# Altium schematic sheet US_BB_SH.SchDoc
size A4
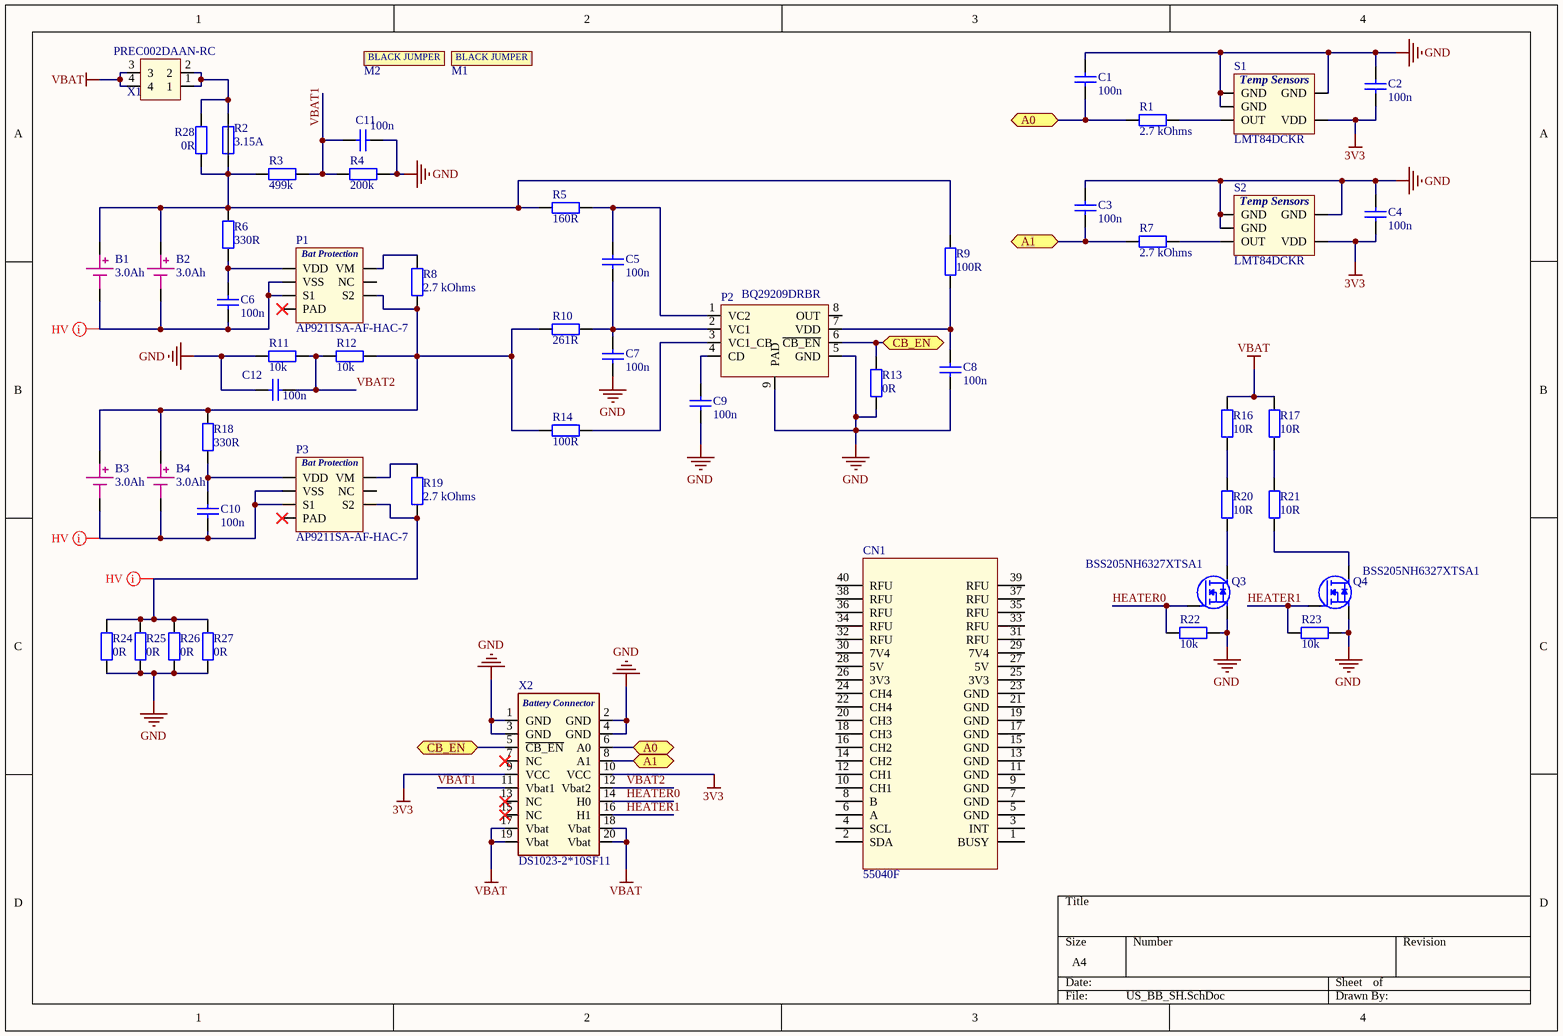
[diagram p0: US_BB_SH.SchDoc]

## Parts
B1  3.0Ah  [BAT18650 1S-MSL]
B2  3.0Ah  [BAT18650 1S-MSL]
B3  3.0Ah  [BAT18650 1S-MSL]
B4  3.0Ah  [BAT18650 1S-MSL]
C1  100n  [C0603_IPC_HD]
C2  100n  [C0603_IPC_HD]
C3  100n  [C0603_IPC_HD]
C4  100n  [C0603_IPC_HD]
C5  100n  [C0603_IPC_HD]
C6  100n  [C0603_IPC_HD]
C7  100n  [C0603_IPC_HD]
C8  100n  [C0603_IPC_HD]
C9  100n  [C0603_IPC_HD]
C10  100n  [C0603_IPC_HD]
C11  100n  [C0603_IPC_HD]
C12  100n  [C0603_IPC_HD]
CN1  55040F  [HEADER_40PIN_12MM2]
M1  STC02SYAN  (value not drawn)  (mechanical)
M2  STC02SYAN  (value not drawn)  (mechanical)
P1  AP9211SA-AF-HAC-7  [U-DFN2030-6 (Type C)]
P2  BQ29209DRBR  [bq29209_SON65P300X100_HS-9N]
P3  AP9211SA-AF-HAC-7  [U-DFN2030-6 (Type C)]
Q3  BSS205NH6327XTSA1  [SOT23]
Q4  BSS205NH6327XTSA1  [SOT23]
R1  2.7 kOhms  [C0805_IPC_HD]
R2  3.15A  [C0603_IPC_MD]
R3  499k  [C0603_IPC_HD]
R4  200k  [C0603_IPC_HD]
R5  160R  [C0805_IPC_HD]
R6  330R  [C0805_IPC_HD]
R7  2.7 kOhms  [C0805_IPC_HD]
R8  2.7 kOhms  [C0805_IPC_HD]
R9  100R  [R0805_IPC_MD]
R10  261R  [C0805_IPC_HD]
R11  10k  [C0603_IPC_HD]
R12  10k  [C0603_IPC_HD]
R13  0R  [R0603_IPC_MD]
R14  100R  [R0805_IPC_MD]
R16  10R  [FMP300JT-73-10R]
R17  10R  [FMP300JT-73-10R]
R18  330R  [C0805_IPC_HD]
R19  2.7 kOhms  [C0805_IPC_HD]
R20  10R  [FMP300JT-73-10R]
R21  10R  [FMP300JT-73-10R]
R22  10k  [C0603_IPC_HD]
R23  10k  [C0603_IPC_HD]
R24  0R  [R0603_IPC_MD]
R25  0R  [R0603_IPC_MD]
R26  0R  [R0603_IPC_MD]
R27  0R  [R0603_IPC_MD]
R28  0R  [R0603_IPC_MD]  (no BOM)
S1  LMT84DCKR  [LMT84DCKR_SOT65P210X110-5N]
S2  LMT84DCKR  [LMT84DCKR_SOT65P210X110-5N]
X1  PREC002DAAN-RC  [GPLD_2X2]
X2  DS1023-2*10SF11  [ESQ-110-33-T-D]

## Ports
A0, A1, CB_EN

## Nets
3V3: C2.1 C4.1 S1.4(VDD) S2.4(VDD) X2.9(VCC) X2.10(VCC)
GND: C1.2 C2.2 C3.2 C4.2 C7.1 C8.1 C9.1 C11.2 C12.1 P2.5(GND) P2.9(PAD) Q3.2(S) Q4.2(S) R4.2 R11.1 R13.1 R22.1 R23.2 R24.1 R25.1 R26.1 R27.1 S1.1(GND) S1.2(GND) S1.5(GND) S2.1(GND) S2.2(GND) S2.5(GND) X2.1(GND) X2.2(GND) X2.3(GND) X2.4(GND)
VBAT: R16.2 R17.2 X1.3 X1.4 X2.17(Vbat) X2.18(Vbat) X2.19(Vbat) X2.20(Vbat)
A0: C1.1 R1.1 X2.6(A0) ; port A0
A1: C3.1 R7.1 X2.8(A1) ; port A1
CB_EN: P2.6(~{CB_EN}) R13.2 X2.5(~{CB_EN}) ; port CB_EN
HEATER0: Q3.1(G) R22.2 X2.14(H0)
HEATER1: Q4.1(G) R23.1 X2.16(H1)
VBAT1: C11.1 R3.2 R4.1 X2.11(Vbat1)
VBAT2: C12.2 R11.2 R12.1 X2.12(Vbat2)
NetB1_1: B1.1 B2.1 R2.1 R3.1 R5.1 R6.2 R9.2 R28.1
NetB1_2: B1.2 B2.2 C6.1 P1.1(S1) P1.2(VSS)
NetB3_1: B3.1 B4.1 P1.6(S2) R8.1 R10.1 R12.2 R14.2 R18.2
NetB3_2: B3.2 B4.2 C10.1 P3.1(S1) P3.2(VSS)
NetC5_1: C5.1 C7.2 P2.2(VC1) R10.2
NetC5_2: C5.2 P2.1(VC2) R5.2
NetC6_2: C6.2 P1.3(VDD) R6.1
NetC8_2: C8.2 P2.7(VDD) R9.1
NetC9_2: C9.2 P2.4(CD)
NetC10_2: C10.2 P3.3(VDD) R18.1
NetP1_5: P1.5(VM) R8.2
NetP2_3: P2.3(VC1_CB) R14.1
NetP3_5: P3.5(VM) R19.2
NetP3_6: P3.6(S2) R19.1 R24.2 R25.2 R26.2 R27.2
NetQ3_3: Q3.3(D) R20.1
NetQ4_3: Q4.3(D) R21.1
NetR1_2: R1.2 S1.3(OUT)
NetR2_2: R2.2 R28.2 X1.1 X1.2
NetR7_2: R7.2 S2.3(OUT)
NetR16_1: R16.1 R20.2
NetR17_1: R17.1 R21.2

Not connected (* = marked no-connect by the designer): CN1 1(BUSY) 2(SDA) 3(INT) 4(SCL) 5(GND) 6(A) 7(GND) 8(B) 9(GND) 10(CH1) 11(GND) 12(CH1) 13(GND) 14(CH2) 15(GND) 16(CH2) 17(GND) 18(CH3) 19(GND) 20(CH3) 21(GND) 22(CH4) 23(GND) 24(CH4) 25(3V3) 26(3V3) 27(5V) 28(5V) 29(7V4) 30(7V4) 31(RFU) 32(RFU) 33(RFU) 34(RFU) 35(RFU) 36(RFU) 37(RFU) 38(RFU) 39(RFU) 40(RFU); P1 4(NC) 7(PAD)*; P2 8(OUT); P3 4(NC) 7(PAD)*; X2 7(NC)* 13(NC)* 15(NC)*

## Layout directives
net class HV: NetB1_2, NetB3_2, NetP3_6

## Notes on the sheet
- (in symbol AP9211SA-AF) Bat Protection
- (in symbol DS1023-2*10SF11) Battery Connector
- (in symbol LMT84DCKR) Temp Sensors
- (in symbol STC02SYAN) BLACK JUMPER

## Library data of the parts
B1-B4 = 18650 3.7V Li-ion: 18650 3.7V Lithium-Ion Battery Rechargeable (Secondary) 2.6Ah; Manufacturer: Litokala; Manufacturer Part Number: Litokala_HG2; Voltage: 3.7V; Capacity: 3.0Ah; Battery Chemistry: Lithium-Ion; Supplier 1: Aliexpress; Supplier Part Number 1: 490-10517-2-ND
C1-C12 = CL10B104KO8NNNC: CAP CER 0.1UF 16V X7R 0603; Manufacturer: Samsung Electro-Mechanics; Manufacturer Part Number: CL10B104KO8NNNC; Voltage: 16V; Value: 100n; Dielectric: X7R; Supplier 1: Digi-Key; Supplier Part Number 1: 1276-1005-1-ND
CN1 = ALFASAT_BIC: CONN HEADER R/A 40POS 2.54MM; Manufacturer: On Shore Technology Inc.; Manufacturer Part Number: 55040F; Supplier 1: LCSC; Supplier Part Number 1: C35165
M1 M2 = STC02SYAN: CONN JUMPER SHORTING TIN; Manufacturer: Sullins Connector Solutions; Manufacturer Part Number: STC02SYAN; Supplier 1: Digi-Key; Supplier Part Number 1: S9000-ND
P1 P3 = AP9211SA-AF: Battery Battery Protection IC Lithium-Ion U-DFN2030-6 (Type C); Manufacturer: Diodes Incorporated; Manufacturer Part Number: AP9211SA-AF-HAC-7; Supplier 1: Digi-Key; Supplier Part Number 1: AP9211SA-AF-HAC-7DICT-ND
P2 = BQ29209DRBR: Battery Battery Protection IC Lithium-Ion 8-SON (3x3); Manufacturer: Texas Instruments; Manufacturer Part Number: BQ29209DRBR; Supplier 1: Digi-Key; Supplier Part Number 1: 296-27677-1-ND
Q3 Q4 = BSS205NH6327XTSA1: N-Channel 20V 2.5A (Ta) 500mW (Ta) Surface Mount SOT-23-3; Manufacturer: Infineon Technologies; Manufacturer Part Number: BSS205NH6327XTSA1; Supplier 1: Digi-Key; Supplier Part Number 1: BSS205NH6327XTSA1CT-ND
R1 R7 R8 R19 = CR0805_RMC_2.7k: RES 2.7K OHM 1% 1/8W 0805; Manufacturer: Stackpole Electronics Inc; Manufacturer Part Number: RMCF0805FT2K70; Value: 2.7 kOhms; Tolarance: 1%; Supplier 1: Digi-Key; Supplier Part Number 1: RMCF0805FT2K70CT-ND
R2 = CR0603_3A15: FUSE BOARD MNT 3.15A 32VDC 0603; Manufacturer: Panasonic Electronic Components; Manufacturer Part Number: ERB-RE3R15V; Current Rating: 3.15A; Supplier 1: Digi-Key; Supplier Part Number 1: P121393CT-ND
R3 = CR0603-JW-499K: RES 499K OHM 1% 1/10W 0603; Manufacturer: Stackpole Electronics Inc; Manufacturer Part Number: RMCF0603FT499K; Value: 499k; Tolarance: ±1%; Supplier 1: Digi-Key; Supplier Part Number 1: RMCF0603FT499KCT-ND
R4 = CR0603-JW-200k: RES 200K OHM 1% 1/10W 0603; Manufacturer: Stackpole Electronics Inc; Manufacturer Part Number: RMCF0603FT200K; Value: 200k; Tolarance: ±1%; Supplier 1: Digi-Key; Supplier Part Number 1: RMCF0603FT200KCT-ND
R5 = CR0805_RMC_160R: RES SMD 160 OHM 1% 1/8W 0805; Manufacturer: Rohm Semiconductor; Manufacturer Part Number: MCR10ERTF1600; Value: 160R; Tolarance: 1%; Supplier 1: Digi-Key; Supplier Part Number 1: RHM160CHCT-ND
R6 R18 = CR0805_RMC_330R: RES 330 OHM 1% 1/8W 0805; Manufacturer: Stackpole Electronics Inc; Manufacturer Part Number: RMCF0805FT330R; Value: 330R; Tolarance: 1%; Supplier 1: Digi-Key; Supplier Part Number 1: RMCF0805FT330RCT-ND
R9 R14 = CR0805_RMC1_100R: RES 100 OHM 1% 1/8W 0805; Manufacturer: Stackpole Electronics Inc; Manufacturer Part Number: RMCF0805FT100R; Value: 100R; Tolarance: ±1%; Supplier 1: Digi-Key; Supplier Part Number 1: RMCF0805FT100RCT-ND
R10 = CR0805_RMC_261R: RES SMD 261 OHM 1% 1/8W 0805; Manufacturer: Rohm Semiconductor; Manufacturer Part Number: MCR10ERTF2610; Value: 261R; Tolarance: 1%; Supplier 1: Digi-Key; Supplier Part Number 1: RHM261CHCT-ND
R11 R12 R22 R23 = CR0603-JW-10k: RES 10K OHM 1% 1/10W 0603; Manufacturer: Stackpole Electronics Inc; Manufacturer Part Number: RMCF0603FT10K0; Value: 10k; Tolarance: ±1%; Supplier 1: Digi-Key; Supplier Part Number 1: RMCF0603FT10K0CT-ND
R13 R24-R28 = CR0603-J/-000ELF: RES SMD 0 OHM JUMPER 1/10W 0603; Manufacturer: Bourns Inc.; Tolarance: 1%; Value: 0R; Manufacturer Part Number: CR0603-J/-000ELF; Supplier 1: Digi-Key; Supplier Part Number 1: CR0603-J/-000ELFCT-ND
R16 R17 R20 R21 = FMP300JT-73-10R: RES 10 OHM 3W 5% AXIAL; Manufacturer: Yageo; Value: 10R; Tolarance: ±5%; Manufacturer Part Number: FMP300JT-73-10R; Supplier 1: Digi-Key; Supplier Part Number 1: 10AXCT-ND
S1 S2 = LMT84DCKR: Temperature Sensor Analog, Local -50°C ~ 150°C 5.5mV/°C SC-70-5; Manufacturer: Texas Instruments; Manufacturer Part Number: LMT84DCKR; Supplier 1: Digi-Key; Supplier Part Number 1: 296-38163-1-ND
X1 = PLD_2X2: Connector Header Through Hole 4 position 0.100" (2.54mm); Manufacturer: Sullins Connector Solutions; Number of Positions: 4; Manufacturer Part Number: PREC002DAAN-RC; Supplier 1: Digi-Key; Supplier Part Number 1: S2012EC-02-ND
X2 = DS1023-2*10SF11: 20 Position Elevated Socket Connector  Through Hole; Manufacturer: CONNFLY Elec; Number of Positions: 20; Manufacturer Part Number: DS1023-2*10SF11; Supplier 1: lcsc.com; Supplier Part Number 1: C92266